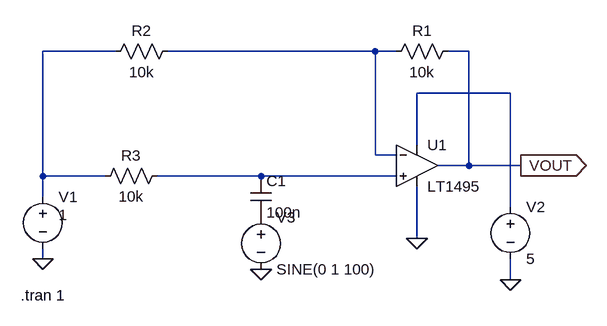
[diagram p0: schematic InputBuffer.asc]
InputBuffer.asc, the LTspice schematic file:
Version 4
SHEET 1 880 680
WIRE -272 0 -384 0
WIRE 128 0 -192 0
WIRE 160 0 128 0
WIRE 272 0 240 0
WIRE 336 64 192 64
WIRE 192 144 192 64
WIRE 128 160 128 0
WIRE 160 160 128 160
WIRE 272 176 272 0
WIRE 272 176 224 176
WIRE 352 176 272 176
WIRE -384 192 -384 0
WIRE -288 192 -384 192
WIRE -48 192 -208 192
WIRE 160 192 -48 192
WIRE -384 224 -384 192
WIRE 336 240 336 64
WIRE 192 288 192 208
WIRE -384 320 -384 304
WIRE 336 352 336 320
FLAG 192 288 0
FLAG -384 320 0
FLAG 336 352 0
FLAG 352 176 VOUT
IOPIN 352 176 Out
FLAG -48 336 0
SYMBOL Opamps\\LT1495 192 112 R0
SYMATTR InstName U1
SYMBOL res 256 -16 R90
WINDOW 0 0 56 VBottom 2
WINDOW 3 32 56 VTop 2
SYMATTR InstName R1
SYMATTR Value 10k
SYMBOL res -176 -16 R90
WINDOW 0 0 56 VBottom 2
WINDOW 3 32 56 VTop 2
SYMATTR InstName R2
SYMATTR Value 10k
SYMBOL res -192 176 R90
WINDOW 0 0 56 VBottom 2
WINDOW 3 32 56 VTop 2
SYMATTR InstName R3
SYMATTR Value 10k
SYMBOL voltage -384 208 R0
WINDOW 3 24 44 Left 2
WINDOW 123 0 0 Left 0
WINDOW 39 0 0 Left 0
SYMATTR InstName V1
SYMATTR Value 1
SYMBOL voltage 336 224 R0
WINDOW 123 0 0 Left 0
WINDOW 39 0 0 Left 0
SYMATTR InstName V2
SYMATTR Value 5
SYMBOL cap -64 192 R0
SYMATTR InstName C1
SYMATTR Value 100n
SYMBOL voltage -48 240 R0
WINDOW 123 0 0 Left 0
WINDOW 39 0 0 Left 0
SYMATTR InstName V3
SYMATTR Value SINE(0 1 100)
TEXT -418 376 Left 2 !.tran 1

The netlist it stands for:
* InputBuffer.asc
XU1 N004 N002 N003 0 VOUT LT1495  ; pins In+ In- V+ V- OUT
R1 VOUT N002 10k
R2 N002 N001 10k
R3 N004 N001 10k
V1 N001 0 1
V2 N003 0 5
C1 N004 P001 100n
V3 P001 0 SINE(0 1 100)
.tran 1
.backanno
.end